# EAGLE schematic PitschuLight V1.1 (EAGLE 6.4)
AUFTRAGS_NR: ----; BEARBEITET: ps; DATUM: 06.07.2013; ERSATZ_FUER: ----; ERSETZT_DURCH: ----; ERSTELLER: ps; GEPRUEFT: n.n.; KD_ZEICHNUNG: ----; KUNDE: ps; NORM: n.a.; URSPRUNG: spontane idee; WERKS_NR: ----; ZEICHNUNGS_NR: 1
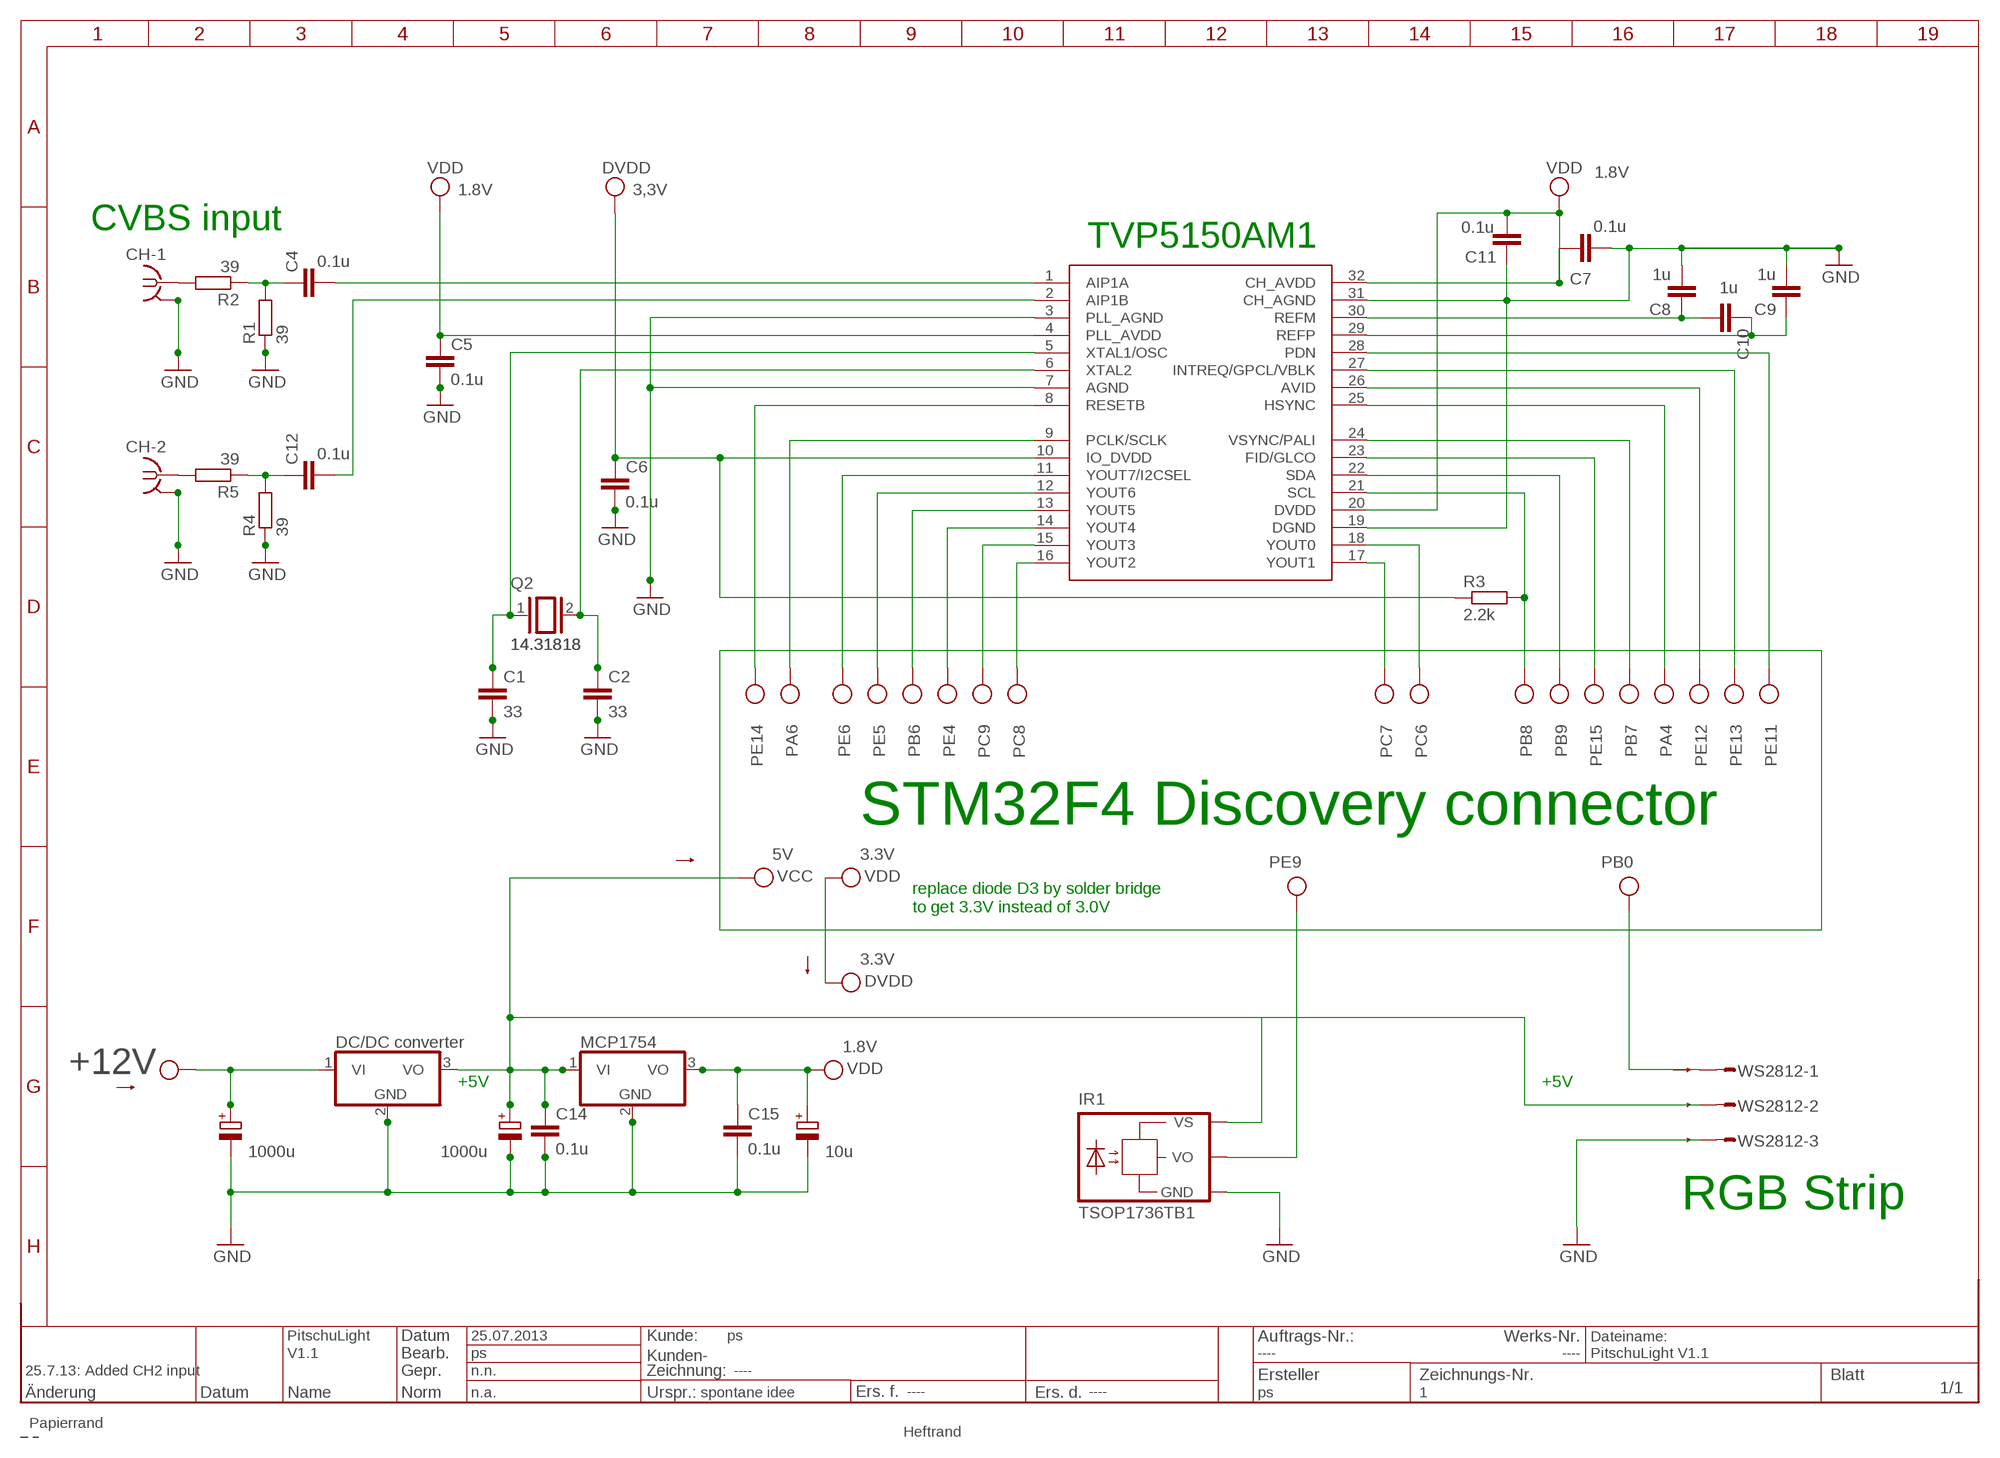
[diagram p0: schematic, sheet 1]
1000U (ELKO): VAL: 1000u
1000U1 (ELKO): VAL: 1000u
1000U2 (ELKO): VAL: 10u
RAHMEN1 (RAHMEN_A4_8Z-19S): AENDERUNG1: 25.7.13: Added CH2 input; DATUM: 25.07.2013; NAME1: PitschuLight; NAME2: V1.1

## Parts
C1  33  C2.5/5  [C2.5-5]
C2  33  C2.5/5  [C2.5-5]
C4  0.1u  C2.5/5  [C2.5-5]
C5  0.1u  C2.5/5  [C2.5-5]
C6  0.1u  C2.5/5  [C2.5-5]
C7  0.1u  C2.5/5  [C2.5-5]
C8  1u  C2.5/5  [C2.5-5]
C9  1u  C2.5/5  [C2.5-5]
C10  1u  C2.5/5  [C2.5-5]
C11  0.1u  C2.5/5  [C2.5-5]
C12  0.1u  C2.5/5  [C2.5-5]
C14  0.1u  C2.5/5  [C2.5-5]
C15  0.1u  C2.5/5  [C2.5-5]
CH-1  COAX  [MMCX-J-P-X-ST-EM1-MKT]
CH-2  COAX  [MMCX-J-P-X-ST-EM1-MKT]
DCDC  DC/DC converter  MCP1703DB  [SOT223]
IC1  MCP1754  MCP1703DB  [SOT223]
IR1  TSOP1736TB1  [TSOP17_TB1]
Q2  14.31818  XTAL/S  [QS]
R1  39  R  [R0805]
R2  39  R  [R0805]
R3  2.2k  R-EU_VTA52  [VTA52]
R4  39  R  [R0805]
R5  39  R  [R0805]
U$1  TVP5150AM1  [TVP5150AM1]
WS2812  data  L03P  [L03P]

## Nets
GND: C1.2 C2.2 C5.2 C6.2 C7.2 C8.2 C9.2 C11.1 C14.2 C15.2 CH-1.2@1(GND) CH-2.2@1(GND) DCDC.2(GND) IC1.2(GND) IR1.GND R1.1 R4.1 U$1.3(PLL_AGND) U$1.7(AGND) U$1.19(DGND) U$1.31(CH_AGND) WS2812.3
N$1: C2.1 Q2.2 U$1.6(XTAL2)
N$2: C1.1 Q2.1 U$1.5(XTAL1/OSC)
N$3: C4.2 U$1.1(AIP1A)
N$4: C12.2 U$1.2(AIP1B)
N$5: C4.1 R1.2 R2.1
N$6: CH-1.1 R2.2
N$8: C8.1 C10.2 U$1.30(REFM)
N$9: C9.1 C10.1 U$1.29(REFP)
N$11: C12.1 R4.2 R5.1
N$12: CH-2.1 R5.2
VCC: DCDC.1(VI) IR1.VO R3.2 U$1.8(RESETB) U$1.9(PCLK/SCLK) U$1.11(YOUT7/I2CSEL) U$1.12(YOUT6) U$1.13(YOUT5) U$1.14(YOUT4) U$1.15(YOUT3) U$1.16(YOUT2) U$1.17(YOUT1) U$1.18(YOUT0) U$1.21(SCL) U$1.22(SDA) U$1.23(FID/GLCO) U$1.24(VSYNC/PALI) U$1.25(HSYNC) U$1.26(AVID) U$1.27(INTREQ/GPCL/VBLK) U$1.28(PDN) ; supply symbol labelled PC8, PC9, PE4, PB6, PE5, PE6, PA6, PE14, PC7, PC6, PB8, PB9, PE15, PB7, PA4, PE12, PE13, PE11, +12V, PE9
VDD: C5.1 C6.1 C7.1 C11.2 C14.1 C15.1 DCDC.3(VO) IC1.1(VI) IC1.3(VO) IR1.VS R3.1 U$1.4(PLL_AVDD) U$1.10(IO_DVDD) U$1.20(DVDD) U$1.32(CH_AVDD) WS2812.2 ; supply symbol labelled DVDD, VCC
WS2812: WS2812.1 ; supply symbol labelled PB0

## Notes on the sheet
- CVBS input
- TVP5150AM1
- STM32F4 Discovery connector
- replace diode D3 by solder bridge
  to get 3.3V instead of 3.0V
- +5V | +5V
- RGB Strip

## Power pins joined to a net without a drawn wire
GND: CH-1.2@2(GND) CH-1.2@3(GND) CH-1.2@4(GND) CH-2.2@2(GND) CH-2.2@3(GND) CH-2.2@4(GND)

## Library data of the parts
C1 C2 C4-C12 C14 C15 = capacitor-wima:C: CAPACITOR naming: grid - package width
CH-1 CH-2 = con-samtec:COAX: MMCX STRAIGHT, EDGE MOUNT JACK- 50 OHM Source: http://www.samtec.com/ftppub/cpdf/MMCX-J-P-X-ST-EM1-MKT.pdf; OC_FARNELL: unknown; OC_NEWARK: unknown
DCDC IC1 = linear:MCP1703: 250 mA, 16V, Low Quiescent Current LDO Regulator Source: http://ww1.microchip.com/downloads/en/DeviceDoc/22049b.pdf
IR1 = telefunken:TSOP17*TB1: TSOP17..TB1 IR Receiver Modules for Remote Control Systems Source: http://www.vishay.com/docs/82042/82042.pdf; OC_FARNELL: unknown; OC_NEWARK: unknown
Q2 = special:XTAL/S: CRYSTAL; VAL: 14.31818
R1 R2 R4 R5 = eagle-ltspice:R: RESISTOR, European symbol; SPICEMODEL: NONE; SPICEPREFIX: R
R3 = rcl:R-EU_: RESISTOR, European symbol
U$1 = tvp5150am1:TVP5150AM1
WS2812 = con-amp-mt:L03P: AMP MT CONNECTOR; OC_FARNELL: unknown; OC_NEWARK: unknown